# EAGLE schematic esquematico (EAGLE 8.4.0)
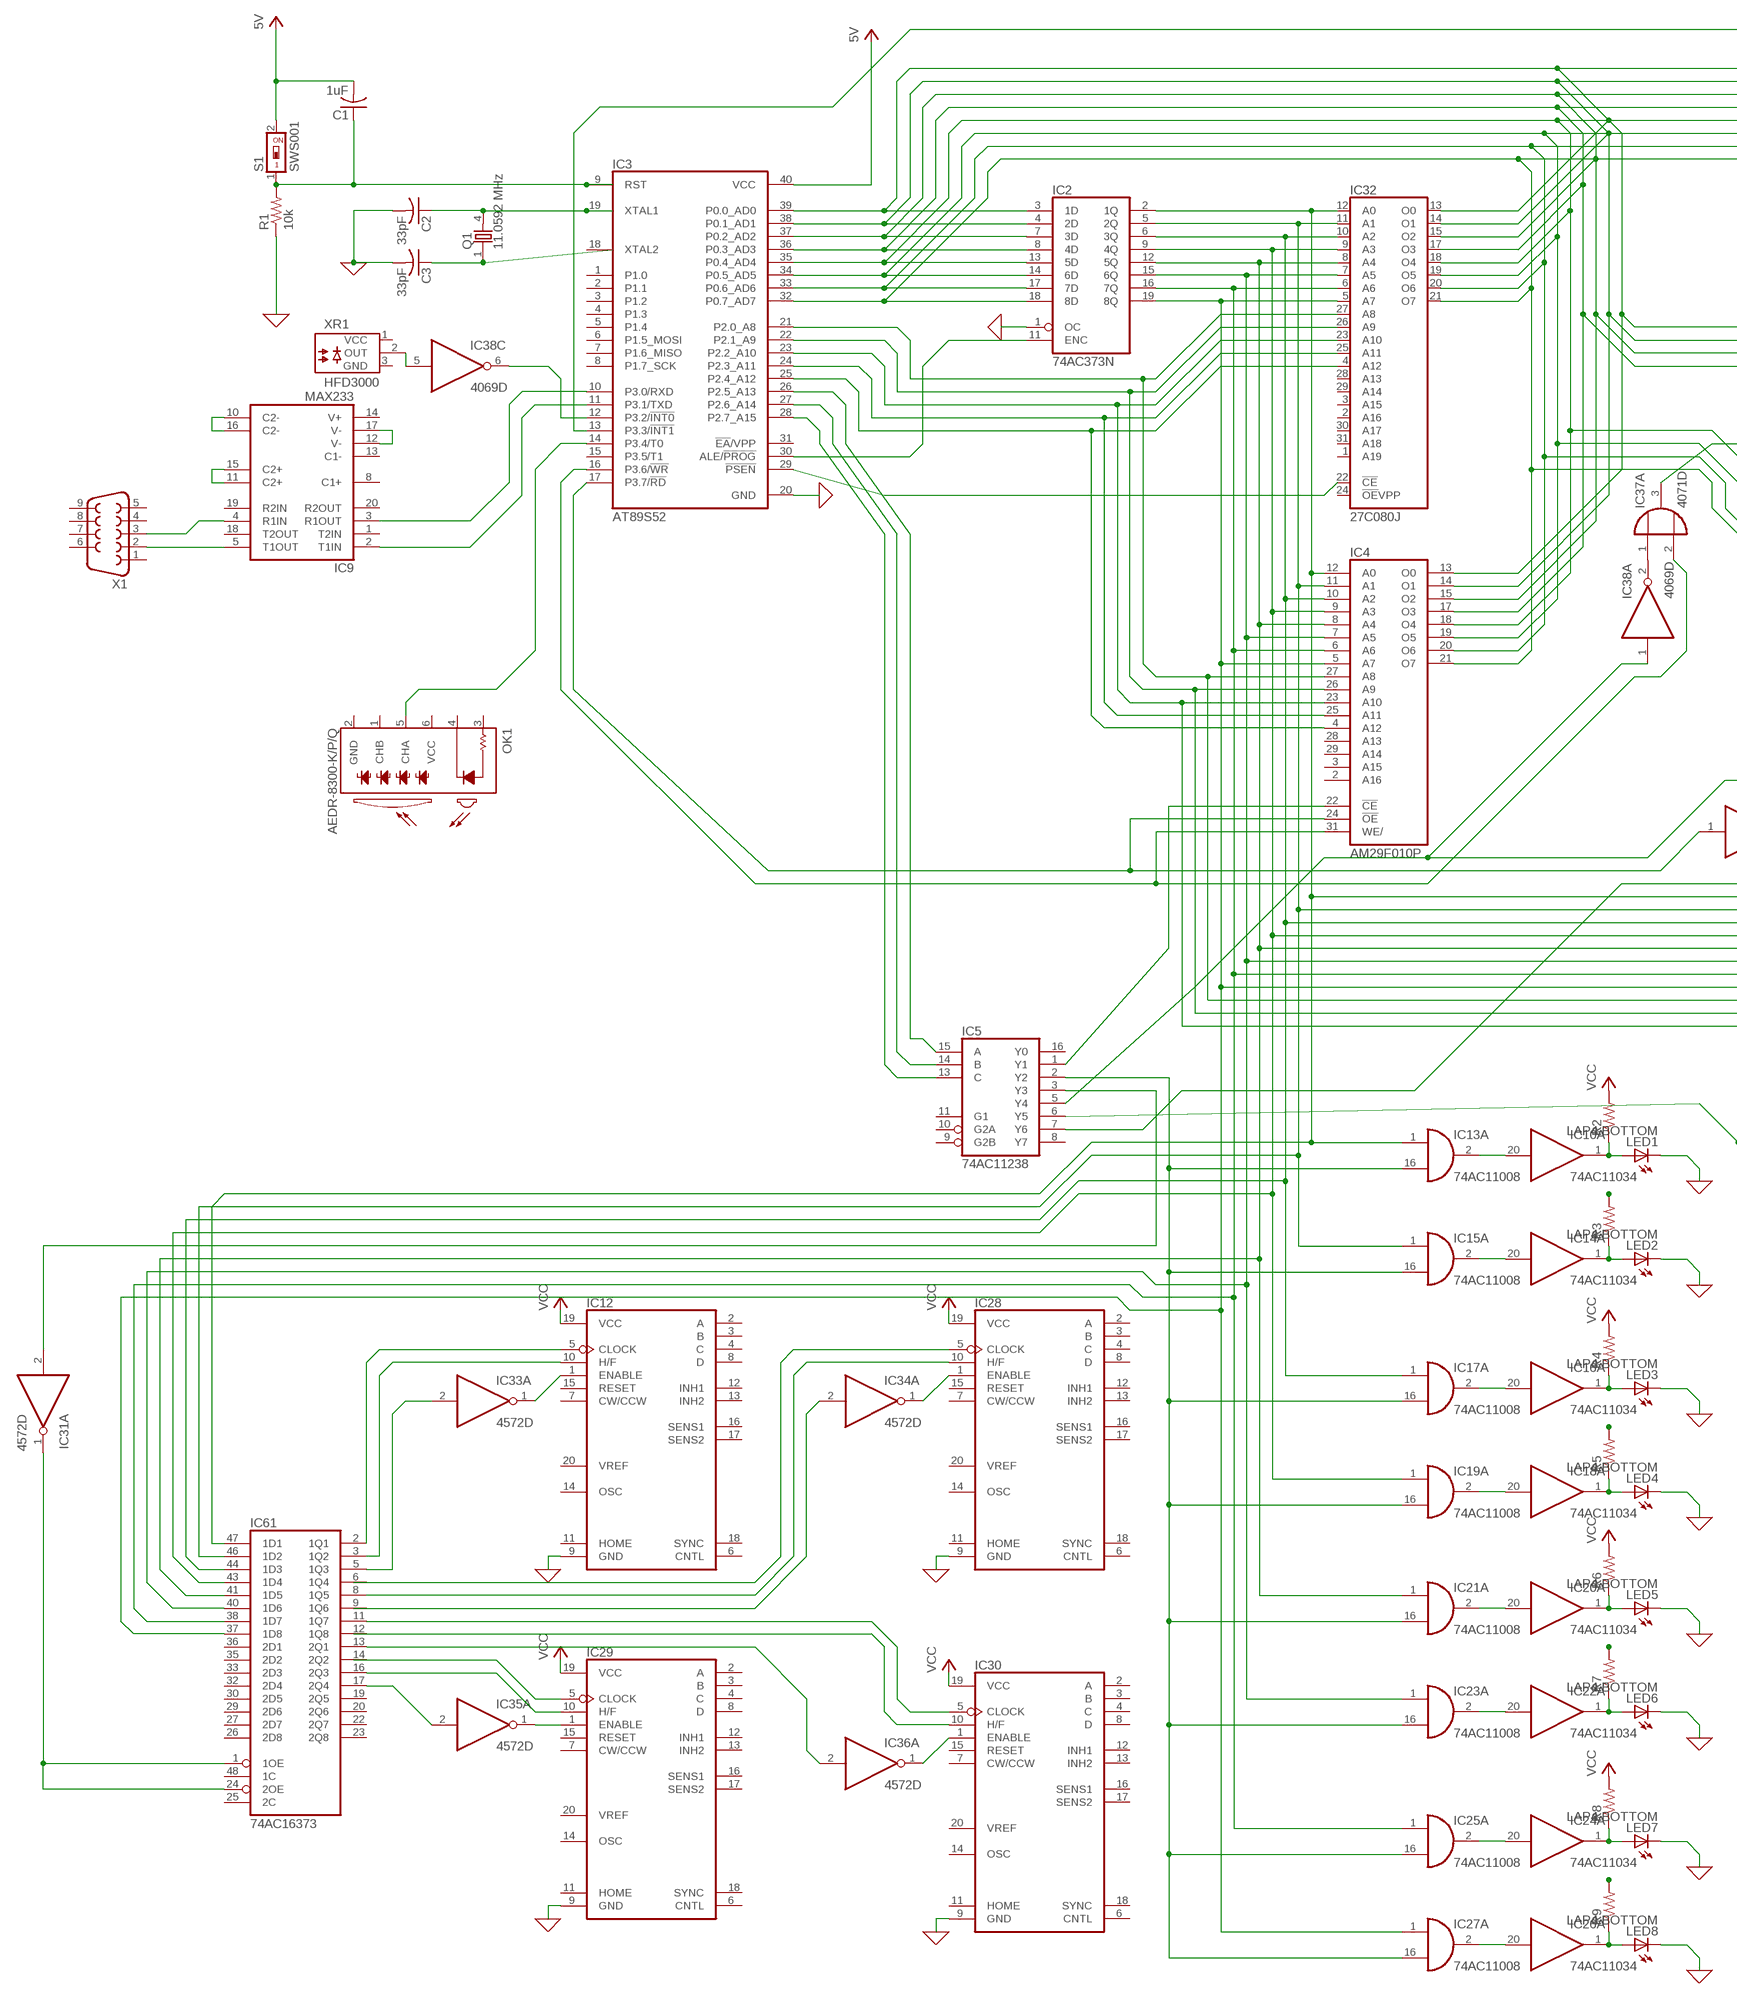
[diagram p0: schematic, sheet 1, part 1 of 2]
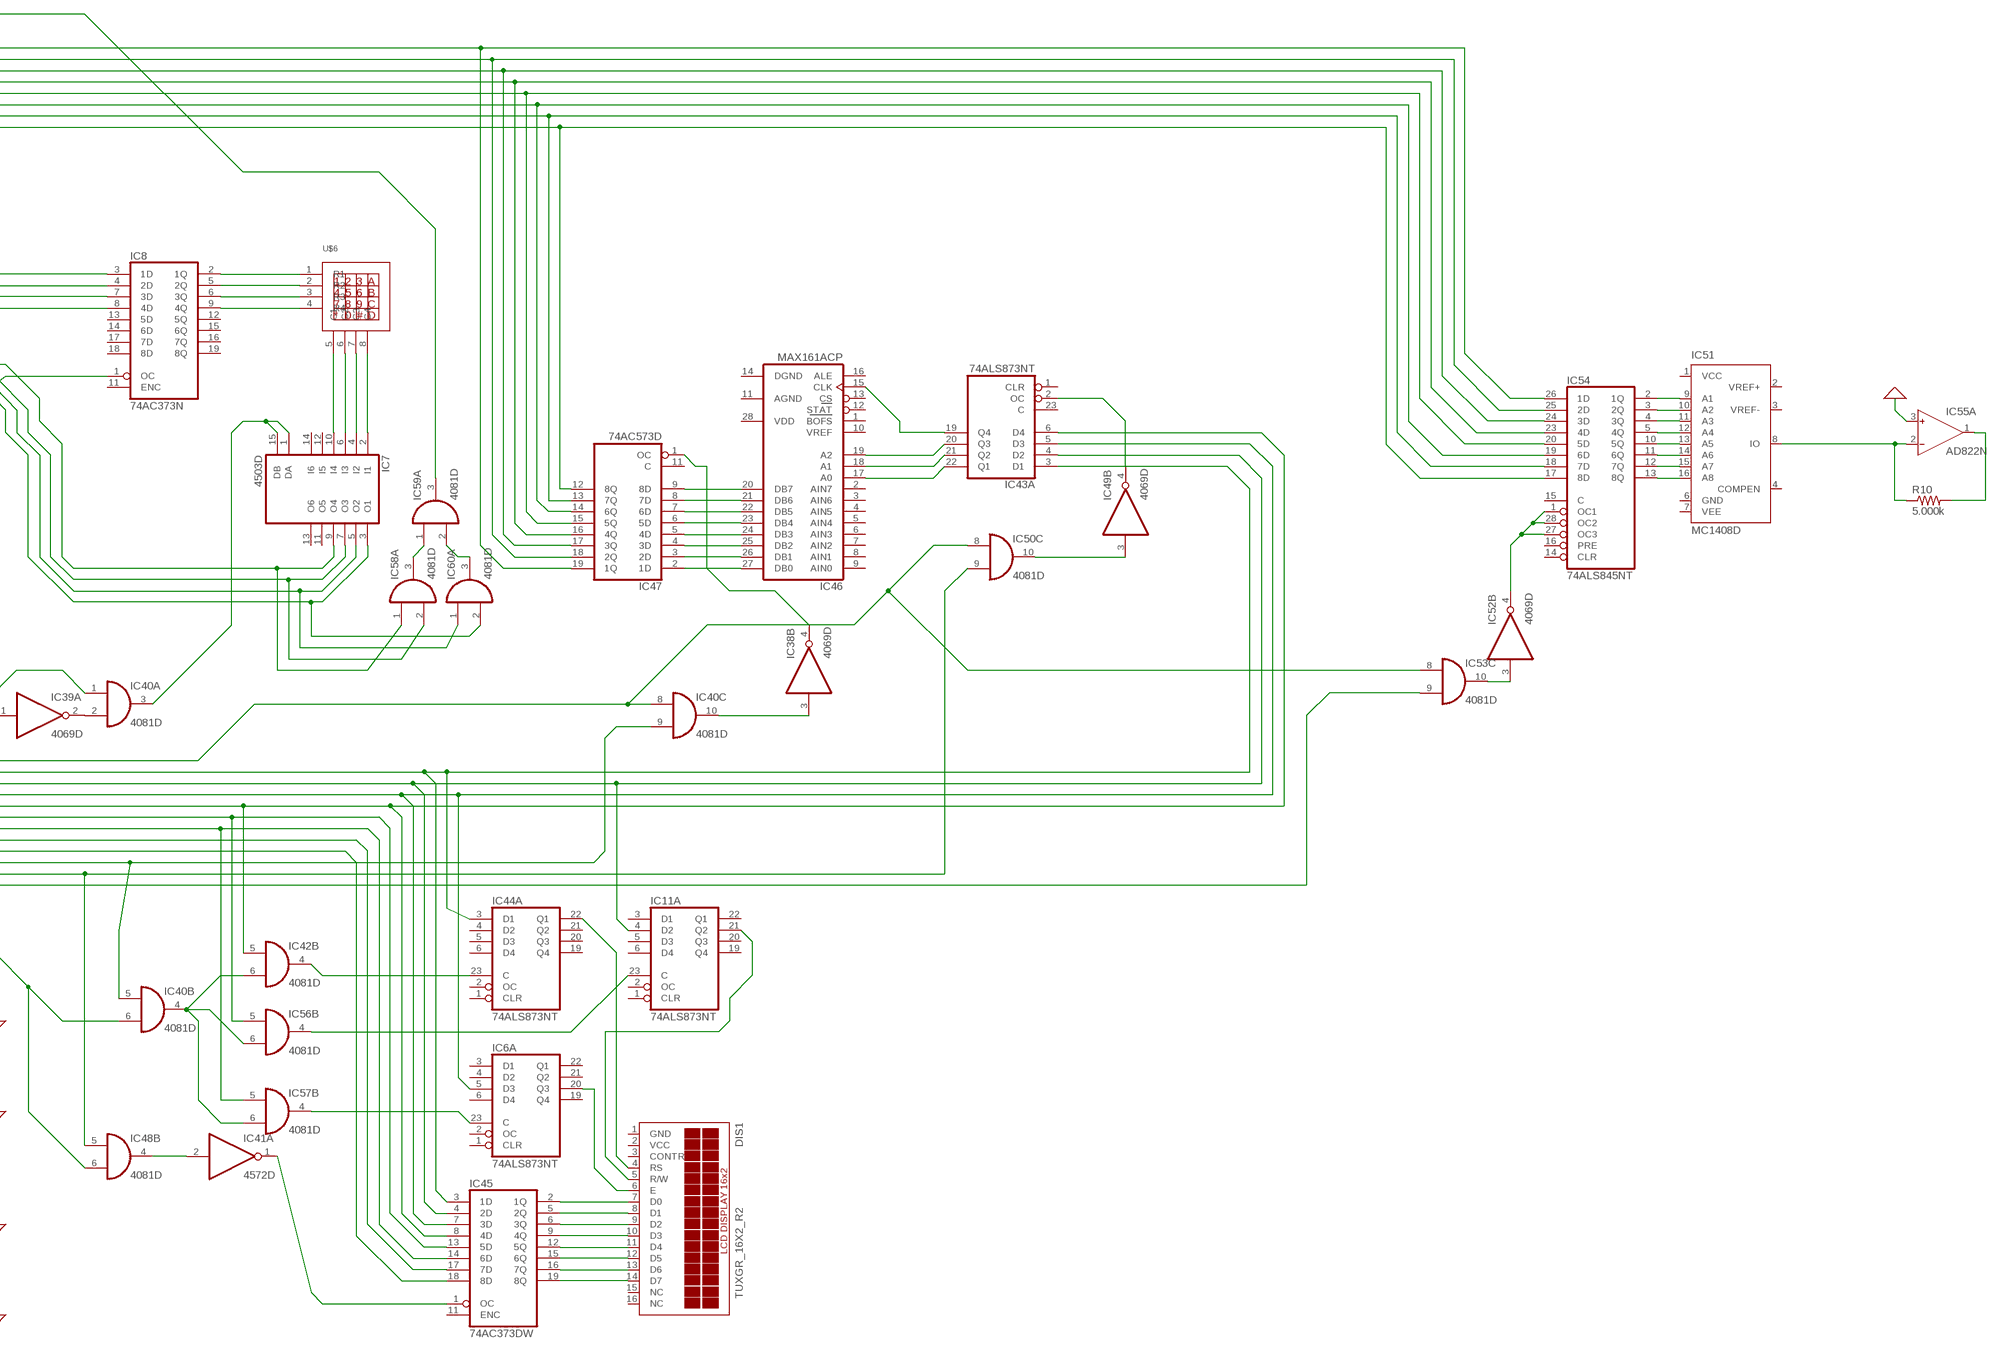
[diagram p1: schematic, sheet 1, part 2 of 2]

## Parts
C1  1uF  C-US025-024X044  [C025-024X044]
C2  33pF  C-US025-024X044  [C025-024X044]
C3  33pF  C-US025-024X044  [C025-024X044]
DIS1  TUXGR_16X2_R2  [TUXGR_16X2_R2]
IC2  74AC373N  [DIL20]
IC3  AT89S52  AT89S51-33P  [DIL40]
IC4  AM29F010P  [DIL32-3]
IC5  74AC11238  [DIL16]
IC6  74ALS873NT  [DIL24-6]
IC7  4503D  [SO16]
IC8  74AC373N  [DIL20]
IC9  MAX233  [DIL20]
IC10  74AC11034  [DIL20]
IC11  74ALS873NT  [DIL24-6]
IC12  L297ADIL20-1  [DIL20]
IC13  74AC11008  [DIL16]
IC14  74AC11034  [DIL20]
IC15  74AC11008  [DIL16]
IC16  74AC11034  [DIL20]
IC17  74AC11008  [DIL16]
IC18  74AC11034  [DIL20]
IC19  74AC11008  [DIL16]
IC20  74AC11034  [DIL20]
IC21  74AC11008  [DIL16]
IC22  74AC11034  [DIL20]
IC23  74AC11008  [DIL16]
IC24  74AC11034  [DIL20]
IC25  74AC11008  [DIL16]
IC26  74AC11034  [DIL20]
IC27  74AC11008  [DIL16]
IC28  L297ADIL20-1  [DIL20]
IC29  L297ADIL20-1  [DIL20]
IC30  L297ADIL20-1  [DIL20]
IC31  4572D  [SO16]
IC32  27C080J  [PLCC32R]
IC33  4572D  [SO16]
IC34  4572D  [SO16]
IC35  4572D  [SO16]
IC36  4572D  [SO16]
IC37  4071D  [SO14]
IC38  4069D  [SO14]
IC39  4069D  [SO14]
IC40  4081D  [SO14]
IC41  4572D  [SO16]
IC42  4081D  [SO14]
IC43  74ALS873NT  [DIL24-6]
IC44  74ALS873NT  [DIL24-6]
IC45  74AC373DW  [SO20W]
IC46  MAX161ACP  [DIL28-6]
IC47  74AC573D  [SO20W]
IC48  4081D  [SO14]
IC49  4069D  [SO14]
IC50  4081D  [SO14]
IC51  MC1408D  [SO16]
IC52  4069D  [SO14]
IC53  4081D  [SO14]
IC54  74ALS845NT  [DIL28-6]
IC55  AD822N  [DIL08]
IC56  4081D  [SO14]
IC57  4081D  [SO14]
IC58  4081D  [SO14]
IC59  4081D  [SO14]
IC60  4081D  [SO14]
IC61  74AC16373  [SSOP48DL]
LED1  LAP4-BOTTOM  [P47F-BOTTOM]
LED2  LAP4-BOTTOM  [P47F-BOTTOM]
LED3  LAP4-BOTTOM  [P47F-BOTTOM]
LED4  LAP4-BOTTOM  [P47F-BOTTOM]
LED5  LAP4-BOTTOM  [P47F-BOTTOM]
LED6  LAP4-BOTTOM  [P47F-BOTTOM]
LED7  LAP4-BOTTOM  [P47F-BOTTOM]
LED8  LAP4-BOTTOM  [P47F-BOTTOM]
OK1  AEDR-8300-K/P/Q  [AEDR-8300]
Q1  11.0592 MHz  86SMX  [86SMX]
R1  10k  R-US_0207/10  [0207/10]
R2  R-US_0204/2V  [0204V]
R3  R-US_0204/2V  [0204V]
R4  R-US_0204/2V  [0204V]
R5  R-US_0204/2V  [0204V]
R6  R-US_0204/2V  [0204V]
R7  R-US_0204/2V  [0204V]
R8  R-US_0204/2V  [0204V]
R9  R-US_0204/2V  [0204V]
R10  5.000k  R-US_0204/2V  [0204V]
S1  SWS001  [SMS-001]
U$6  KEYPAD4X4  [KEYPAD4X4]
X1  F09VB  [F09VB]
XR1  HFD3000  [TO46-FW3]

## Nets
0: C2.2 C3.2 IC2.1(OC) IC3.20(GND) IC12.9(GND) IC28.9(GND) IC29.9(GND) IC30.9(GND) IC55.3(A:IN+) LED1.C LED2.C LED3.C LED4.C LED5.C LED6.C LED7.C LED8.C R1.1 ; supply symbol labelled GND
N$1: C2.1 IC3.19(XTAL1) Q1.4
N$2: C3.1 Q1.1
N$3: C1.1 IC3.9(RST) R1.2 S1.1
N$4: DIS1.6(E) IC6.20(A:Q3)
N$5: IC4.22(!CE) IC5.1(Y1)
N$6: IC2.7(3D) IC3.37(P0.2_AD2) IC4.15(O2) IC8.7(3D) IC32.15(O2) IC47.17(3Q) IC54.24(3D)
N$7: IC2.14(6D) IC3.34(P0.5_AD5) IC4.19(O5) IC7.7(O3) IC32.19(O5) IC47.14(6Q) IC54.19(6D) IC58.2(A:I1)
N$8: IC3.10(P3.0/RXD) IC9.3(R1OUT)
N$9: IC8.2(1Q) U$6.1(R1)
N$10: IC2.3(1D) IC3.39(P0.0_AD0) IC4.13(O0) IC8.3(1D) IC32.13(O0) IC47.19(1Q) IC54.26(1D)
N$11: IC2.18(8D) IC3.32(P0.7_AD7) IC4.21(O7) IC7.3(O1) IC32.21(O7) IC47.12(8Q) IC54.17(8D) IC60.2(A:I1)
N$12: IC2.11(ENC) IC3.30(ALE/!PROG)
N$13: IC2.2(1Q) IC4.12(A0) IC13.1(A:I0) IC32.12(A0) IC43.3(A:D1) IC44.3(A:D1) IC45.3(1D) IC61.47(1D1)
N$14: IC2.5(2Q) IC4.11(A1) IC11.4(A:D2) IC15.1(A:I0) IC32.11(A1) IC43.4(A:D2) IC45.4(2D) IC61.46(1D2)
N$15: IC38.5(C:I) XR1.2(OUT)
N$16: IC2.9(4Q) IC4.9(A3) IC19.1(A:I0) IC32.9(A3) IC42.5(B:I0) IC43.6(A:D4) IC45.8(4D) IC61.43(1D4)
N$17: IC2.12(5Q) IC4.8(A4) IC21.1(A:I0) IC32.8(A4) IC45.13(5D) IC56.5(B:I0) IC61.41(1D5)
N$18: IC2.19(8Q) IC4.5(A7) IC27.1(A:I0) IC32.5(A7) IC45.18(8D) IC61.37(1D8)
N$19: IC3.12(P3.2/!INT0) IC38.6(C:O)
N$20: IC3.28(P2.7_A15) IC5.13(C)
N$21: IC3.21(P2.0_A8) IC4.27(A8) IC32.27(A8) IC40.5(B:I0) IC40.9(C:I1)
N$22: IC3.22(P2.1_A9) IC4.26(A9) IC32.26(A9) IC48.5(B:I0) IC50.9(C:I1)
N$23: IC3.23(P2.2_A10) IC4.23(A10) IC32.23(A10) IC53.9(C:I1)
N$24: IC3.24(P2.3_A11) IC4.25(A11) IC32.25(A11)
N$25: IC3.27(P2.6_A14) IC5.14(B)
N$26: DIS1.5(R/W) IC11.21(A:Q2)
N$27: IC8.5(2Q) U$6.2(R2)
N$28: IC3.25(P2.4_A12) IC4.4(A12) IC32.4(A12)
N$30: IC8.6(3Q) U$6.3(R3)
N$31: IC3.29(!PSEN)
N$33: IC2.15(6Q) IC4.7(A5) IC23.1(A:I0) IC32.7(A5) IC45.14(6D) IC57.5(B:I0) IC61.40(1D6)
N$34: IC8.9(4Q) U$6.4(R4)
N$35: IC7.2(I1) U$6.8(C4)
N$36: IC2.17(7D) IC3.33(P0.6_AD6) IC4.20(O6) IC7.5(O2) IC32.20(O6) IC47.13(7Q) IC54.18(7D) IC60.1(A:I0)
N$37: IC2.8(4D) IC3.36(P0.3_AD3) IC4.17(O3) IC8.8(4D) IC32.17(O3) IC47.16(4Q) IC54.23(4D)
N$38: IC7.4(I2) U$6.7(C3)
N$39: IC2.4(2D) IC3.38(P0.1_AD1) IC4.14(O1) IC8.4(2D) IC32.14(O1) IC47.18(2Q) IC54.25(2D)
N$40: IC7.6(I3) U$6.6(C2)
N$41: IC7.10(I4) U$6.5(C1)
N$42: IC2.13(5D) IC3.35(P0.4_AD4) IC4.18(O4) IC7.9(O4) IC32.18(O4) IC47.15(5Q) IC54.20(5D) IC58.1(A:I0)
N$43: IC3.11(P3.1/TXD) IC9.2(T1IN)
N$44: IC9.4(R1IN) X1.3
N$45: IC9.5(T1OUT) X1.2
N$46: IC9.10(C2-) IC9.16(C2-)
N$47: IC9.11(C2+) IC9.15(C2+)
N$48: IC9.12(V-) IC9.17(V-)
N$49: IC10.20(A:I) IC13.2(A:O)
N$50: IC10.1(A:O) LED1.A R2.1
N$51: IC3.26(P2.5_A13) IC5.15(A)
N$52: DIS1.4(RS) IC44.22(A:Q1)
N$53: IC31.1(A:O) IC61.1(1OE) IC61.24(2OE)
N$54: IC12.5(CLOCK) IC61.2(1Q1)
N$55: IC14.20(A:I) IC15.2(A:O)
N$56: IC14.1(A:O) LED2.A R3.1
N$57: IC12.10(H/F) IC61.3(1Q2)
N$58: IC16.20(A:I) IC17.2(A:O)
N$59: IC16.1(A:O) LED3.A R4.1
N$60: IC33.2(A:I) IC61.5(1Q3)
N$61: IC18.20(A:I) IC19.2(A:O)
N$62: IC18.1(A:O) LED4.A R5.1
N$63: IC5.3(Y3) IC31.2(A:I)
N$64: IC20.20(A:I) IC21.2(A:O)
N$65: IC20.1(A:O) LED5.A R6.1
N$66: IC12.1(ENABLE) IC33.1(A:O)
N$67: IC22.20(A:I) IC23.2(A:O)
N$68: IC22.1(A:O) LED6.A R7.1
N$69: IC3.17(P3.7/!RD) IC4.24(!OE) IC39.1(A:I)
N$70: IC24.20(A:I) IC25.2(A:O)
N$71: IC24.1(A:O) LED7.A R8.1
N$72: IC28.5(CLOCK) IC61.6(1Q4)
N$73: IC26.20(A:I) IC27.2(A:O)
N$74: IC26.1(A:O) LED8.A R9.1
N$75: IC28.10(H/F) IC61.8(1Q5)
N$76: IC34.2(A:I) IC61.9(1Q6)
N$77: IC30.5(CLOCK) IC61.11(1Q7)
N$78: IC30.10(H/F) IC61.12(1Q8)
N$79: IC36.2(A:I) IC61.13(2Q1)
N$80: IC29.5(CLOCK) IC61.14(2Q2)
N$81: IC29.10(H/F) IC61.16(2Q3)
N$82: IC29.1(ENABLE) IC35.1(A:O)
N$83: IC35.2(A:I) IC61.17(2Q4)
N$84: IC5.5(Y4) IC38.1(A:I) IC40.1(A:I0)
N$85: IC28.1(ENABLE) IC34.1(A:O)
N$86: IC8.1(OC) IC37.3(A:O)
N$87: IC30.1(ENABLE) IC36.1(A:O)
N$88: IC37.1(A:I0) IC38.2(A:O)
N$89: IC39.2(A:O) IC40.2(A:I1)
N$90: IC7.1(DA) IC7.15(DB) IC40.3(A:O)
N$91: IC5.6(Y5) IC40.6(B:I1) IC48.6(B:I1)
N$92: IC40.4(B:O) IC42.6(B:I1) IC56.6(B:I1) IC57.6(B:I1)
N$93: IC42.4(B:O) IC44.23(A:C)
N$94: IC11.23(A:C) IC56.4(B:O)
N$95: DIS1.7(D0) IC45.2(1Q)
N$96: DIS1.8(D1) IC45.5(2Q)
N$97: DIS1.9(D2) IC45.6(3Q)
N$98: DIS1.10(D3) IC45.9(4Q)
N$99: DIS1.11(D4) IC45.12(5Q)
N$100: DIS1.12(D5) IC45.15(6Q)
N$101: DIS1.13(D6) IC45.16(7Q)
N$102: DIS1.14(D7) IC45.19(8Q)
N$103: IC6.23(A:C) IC57.4(B:O)
N$104: IC43.22(A:Q1) IC46.17(A0)
N$105: IC41.1(A:O) IC45.1(OC)
N$106: IC43.21(A:Q2) IC46.18(A1)
N$107: IC43.20(A:Q3) IC46.19(A2)
N$108: IC43.19(A:Q4) IC46.15(CLK)
N$109: IC46.20(DB7) IC47.9(8D)
N$110: IC46.21(DB6) IC47.8(7D)
N$111: IC46.22(DB5) IC47.7(6D)
N$112: IC46.23(DB4) IC47.6(5D)
N$113: IC46.24(DB3) IC47.5(4D)
N$114: IC46.26(DB1) IC47.3(2D)
N$115: IC46.25(DB2) IC47.4(3D)
N$116: IC46.27(DB0) IC47.2(1D)
N$117: IC41.2(A:I) IC48.4(B:O)
N$118: IC49.3(B:I) IC50.10(C:O)
N$119: IC3.14(P3.4/T0) OK1.5(CHA)
N$120: IC58.3(A:O) IC59.1(A:I0)
N$121: IC43.2(A:OC) IC49.4(B:O)
N$122: IC5.7(Y6) IC40.8(C:I0) IC50.8(C:I0) IC53.8(C:I0)
N$123: IC38.3(B:I) IC40.10(C:O)
N$124: IC38.4(B:O) IC47.1(OC)
N$125: IC52.3(B:I) IC53.10(C:O)
N$126: IC59.2(A:I1) IC60.3(A:O)
N$127: IC52.4(B:O) IC54.1(OC1) IC54.27(OC3) IC54.28(OC2)
N$128: IC3.13(P3.3/!INT1) IC59.3(A:O)
N$129: IC2.16(7Q) IC4.6(A6) IC25.1(A:I0) IC32.6(A6) IC45.17(7D) IC61.38(1D7)
N$130: IC5.2(Y2) IC13.16(A:I1) IC15.16(A:I1) IC17.16(A:I1) IC19.16(A:I1) IC21.16(A:I1) IC23.16(A:I1) IC25.16(A:I1) IC27.16(A:I1)
N$131: IC2.6(3Q) IC4.10(A2) IC6.5(A:D3) IC17.1(A:I0) IC32.10(A2) IC43.5(A:D3) IC45.7(3D) IC61.44(1D3)
N$132: IC3.16(P3.6/!WR) IC4.31(WE/) IC37.2(A:I1)
N$134: IC51.9(A1) IC54.2(1Q)
N$135: IC51.10(A2) IC54.3(2Q)
N$136: IC51.11(A3) IC54.4(3Q)
N$137: IC51.12(A4) IC54.5(4Q)
N$138: IC51.13(A5) IC54.10(5Q)
N$139: IC51.14(A6) IC54.11(6Q)
N$140: IC51.15(A7) IC54.12(7Q)
N$141: IC51.16(A8) IC54.13(8Q)
N$142: IC51.8(IO) IC55.2(A:IN-) R10.1
N$144: IC55.1(A:OUT) R10.2
VCC: C1.2 IC3.40(VCC) IC12.19(VCC) IC28.19(VCC) IC29.19(VCC) IC30.19(VCC) R2.2 R4.2 R6.2 R8.2 S1.2 ; supply symbol labelled 5V
VCC1: R3.2
VCC2: R5.2
VCC3: R7.2
VCC4: R9.2
Unconnected: DIS1.3(CONTR) DIS1.15(NC) DIS1.16(NC) IC3.1(P1.0) IC3.2(P1.1) IC3.3(P1.2) IC3.4(P1.3) IC3.5(P1.4) IC3.6(P1.5_MOSI) IC3.7(P1.6_MISO) IC3.8(P1.7_SCK) IC3.15(P3.5/T1) IC3.18(XTAL2) IC3.31(!EA!/VPP) IC4.1(NC) IC4.2(A16) IC4.3(A15) IC4.28(A13) IC4.29(A14) IC4.30(NC) IC5.8(Y7) IC5.9(G2B) IC5.10(G2A) IC5.11(G1) IC5.16(Y0) IC6.1(A:CLR) IC6.2(A:OC) IC6.3(A:D1) IC6.4(A:D2) IC6.6(A:D4) IC6.7(B:D1) IC6.8(B:D2) IC6.9(B:D3) IC6.10(B:D4) IC6.11(B:OC) IC6.13(B:CLR) IC6.14(B:C) IC6.15(B:Q4) IC6.16(B:Q3) IC6.17(B:Q2) IC6.18(B:Q1) IC6.19(A:Q4) IC6.21(A:Q2) IC6.22(A:Q1) IC7.11(O5) IC7.12(I5) IC7.13(O6) IC7.14(I6) IC8.11(ENC) IC8.12(5Q) IC8.13(5D) IC8.14(6D) IC8.15(6Q) IC8.16(7Q) IC8.17(7D) IC8.18(8D) IC8.19(8Q) IC9.1(T2IN) IC9.8(C1+) IC9.13(C1-) IC9.14(V+) IC9.18(T2OUT) IC9.19(R2IN) IC9.20(R2OUT) IC10.2(B:O) IC10.3(C:O) IC10.8(D:O) IC10.9(E:O) IC10.10(F:O) IC10.11(F:I) IC10.12(E:I) IC10.13(D:I) IC10.18(C:I) IC10.19(B:I) IC11.1(A:CLR) IC11.2(A:OC) IC11.3(A:D1) IC11.5(A:D3) IC11.6(A:D4) IC11.7(B:D1) IC11.8(B:D2) IC11.9(B:D3) IC11.10(B:D4) IC11.11(B:OC) IC11.13(B:CLR) IC11.14(B:C) IC11.15(B:Q4) IC11.16(B:Q3) IC11.17(B:Q2) IC11.18(B:Q1) IC11.19(A:Q4) IC11.20(A:Q3) IC11.22(A:Q1) IC12.2(A) IC12.3(B) IC12.4(C) IC12.6(CNTL) IC12.7(CW/CCW) IC12.8(D) IC12.11(HOME) IC12.12(INH1) IC12.13(INH2) IC12.14(OSC) IC12.15(RESET) IC12.16(SENS1) IC12.17(SENS2) IC12.18(SYNC) IC12.20(VREF) IC13.3(B:O) IC13.6(C:O) IC13.7(D:O) IC13.8(D:I1) IC13.9(D:I0) IC13.10(C:I1) IC13.11(C:I0) IC13.14(B:I1) IC13.15(B:I0) IC14.2(B:O) IC14.3(C:O) IC14.8(D:O) IC14.9(E:O) IC14.10(F:O) IC14.11(F:I) IC14.12(E:I) IC14.13(D:I) IC14.18(C:I) IC14.19(B:I) IC15.3(B:O) IC15.6(C:O) IC15.7(D:O) IC15.8(D:I1) IC15.9(D:I0) IC15.10(C:I1) IC15.11(C:I0) IC15.14(B:I1) IC15.15(B:I0) IC16.2(B:O) IC16.3(C:O) IC16.8(D:O) IC16.9(E:O) IC16.10(F:O) IC16.11(F:I) IC16.12(E:I) IC16.13(D:I) IC16.18(C:I) IC16.19(B:I) IC17.3(B:O) IC17.6(C:O) IC17.7(D:O) IC17.8(D:I1) IC17.9(D:I0) IC17.10(C:I1) IC17.11(C:I0) IC17.14(B:I1) IC17.15(B:I0) IC18.2(B:O) IC18.3(C:O) IC18.8(D:O) IC18.9(E:O) IC18.10(F:O) IC18.11(F:I) IC18.12(E:I) IC18.13(D:I) IC18.18(C:I) IC18.19(B:I) IC19.3(B:O) IC19.6(C:O) IC19.7(D:O) IC19.8(D:I1) IC19.9(D:I0) IC19.10(C:I1) IC19.11(C:I0) IC19.14(B:I1) IC19.15(B:I0) IC20.2(B:O) IC20.3(C:O) IC20.8(D:O) IC20.9(E:O) IC20.10(F:O) IC20.11(F:I) IC20.12(E:I) IC20.13(D:I) IC20.18(C:I) IC20.19(B:I) IC21.3(B:O) IC21.6(C:O) IC21.7(D:O) IC21.8(D:I1) IC21.9(D:I0) IC21.10(C:I1) IC21.11(C:I0) IC21.14(B:I1) IC21.15(B:I0) IC22.2(B:O) IC22.3(C:O) IC22.8(D:O) IC22.9(E:O) IC22.10(F:O) IC22.11(F:I) IC22.12(E:I) IC22.13(D:I) IC22.18(C:I) IC22.19(B:I) IC23.3(B:O) IC23.6(C:O) IC23.7(D:O) IC23.8(D:I1) IC23.9(D:I0) IC23.10(C:I1) IC23.11(C:I0) IC23.14(B:I1) IC23.15(B:I0) IC24.2(B:O) IC24.3(C:O) IC24.8(D:O) IC24.9(E:O) IC24.10(F:O) IC24.11(F:I) IC24.12(E:I) IC24.13(D:I) IC24.18(C:I) IC24.19(B:I) IC25.3(B:O) IC25.6(C:O) IC25.7(D:O) IC25.8(D:I1) IC25.9(D:I0) IC25.10(C:I1) IC25.11(C:I0) IC25.14(B:I1) IC25.15(B:I0) IC26.2(B:O) IC26.3(C:O) IC26.8(D:O) IC26.9(E:O) IC26.10(F:O) IC26.11(F:I) IC26.12(E:I) IC26.13(D:I) IC26.18(C:I) IC26.19(B:I) IC27.3(B:O) IC27.6(C:O) IC27.7(D:O) IC27.8(D:I1) IC27.9(D:I0) IC27.10(C:I1) IC27.11(C:I0) IC27.14(B:I1) IC27.15(B:I0) IC28.2(A) IC28.3(B) IC28.4(C) IC28.6(CNTL) IC28.7(CW/CCW) IC28.8(D) IC28.11(HOME) IC28.12(INH1) IC28.13(INH2) IC28.14(OSC) IC28.15(RESET) IC28.16(SENS1) IC28.17(SENS2) IC28.18(SYNC) IC28.20(VREF) IC29.2(A) IC29.3(B) IC29.4(C) IC29.6(CNTL) IC29.7(CW/CCW) IC29.8(D) IC29.11(HOME) IC29.12(INH1) IC29.13(INH2) IC29.14(OSC) IC29.15(RESET) IC29.16(SENS1) IC29.17(SENS2) IC29.18(SYNC) IC29.20(VREF) IC30.2(A) IC30.3(B) IC30.4(C) IC30.6(CNTL) IC30.7(CW/CCW) IC30.8(D) IC30.11(HOME) IC30.12(INH1) IC30.13(INH2) IC30.14(OSC) IC30.15(RESET) IC30.16(SENS1) IC30.17(SENS2) IC30.18(SYNC) IC30.20(VREF) IC31.3(B:O) IC31.4(B:I) IC31.5(E:O) IC31.6(E:I0) IC31.7(E:I1) IC31.9(C:O) IC31.10(C:I) IC31.11(D:O) IC31.12(D:I) IC31.13(F:O) IC31.14(F:I0) IC31.15(F:I1) IC32.1(A19) IC32.2(A16) IC32.3(A15) IC32.22(!CE) IC32.24(!OE!VPP) IC32.28(A13) IC32.29(A14) IC32.30(A17) IC32.31(A18) IC33.3(B:O) IC33.4(B:I) IC33.5(E:O) IC33.6(E:I0) IC33.7(E:I1) IC33.9(C:O) IC33.10(C:I) IC33.11(D:O) IC33.12(D:I) IC33.13(F:O) IC33.14(F:I0) IC33.15(F:I1) IC34.3(B:O) IC34.4(B:I) IC34.5(E:O) IC34.6(E:I0) IC34.7(E:I1) IC34.9(C:O) IC34.10(C:I) IC34.11(D:O) IC34.12(D:I) IC34.13(F:O) IC34.14(F:I0) IC34.15(F:I1) IC35.3(B:O) IC35.4(B:I) IC35.5(E:O) IC35.6(E:I0) IC35.7(E:I1) IC35.9(C:O) IC35.10(C:I) IC35.11(D:O) IC35.12(D:I) IC35.13(F:O) IC35.14(F:I0) IC35.15(F:I1) IC36.3(B:O) IC36.4(B:I) IC36.5(E:O) IC36.6(E:I0) IC36.7(E:I1) IC36.9(C:O) IC36.10(C:I) IC36.11(D:O) IC36.12(D:I) IC36.13(F:O) IC36.14(F:I0) IC36.15(F:I1) IC37.4(B:O) IC37.5(B:I0) IC37.6(B:I1) IC37.8(C:I0) IC37.9(C:I1) IC37.10(C:O) IC37.11(D:O) IC37.12(D:I0) IC37.13(D:I1) IC38.8(D:O) IC38.9(D:I) IC38.10(E:O) IC38.11(E:I) IC38.12(F:O) IC38.13(F:I) IC39.3(B:I) IC39.4(B:O) IC39.5(C:I) IC39.6(C:O) IC39.8(D:O) IC39.9(D:I) IC39.10(E:O) IC39.11(E:I) IC39.12(F:O) IC39.13(F:I) IC40.11(D:O) IC40.12(D:I0) IC40.13(D:I1) IC41.3(B:O) IC41.4(B:I) IC41.5(E:O) IC41.6(E:I0) IC41.7(E:I1) IC41.9(C:O) IC41.10(C:I) IC41.11(D:O) IC41.12(D:I) IC41.13(F:O) IC41.14(F:I0) IC41.15(F:I1) IC42.1(A:I0) IC42.2(A:I1) IC42.3(A:O) IC42.8(C:I0) IC42.9(C:I1) IC42.10(C:O) IC42.11(D:O) IC42.12(D:I0) IC42.13(D:I1) IC43.1(A:CLR) IC43.7(B:D1) IC43.8(B:D2) IC43.9(B:D3) IC43.10(B:D4) IC43.11(B:OC) IC43.13(B:CLR) IC43.14(B:C) IC43.15(B:Q4) IC43.16(B:Q3) IC43.17(B:Q2) IC43.18(B:Q1) IC43.23(A:C) IC44.1(A:CLR) IC44.2(A:OC) IC44.4(A:D2) IC44.5(A:D3) IC44.6(A:D4) IC44.7(B:D1) IC44.8(B:D2) IC44.9(B:D3) IC44.10(B:D4) IC44.11(B:OC) IC44.13(B:CLR) IC44.14(B:C) IC44.15(B:Q4) IC44.16(B:Q3) IC44.17(B:Q2) IC44.18(B:Q1) IC44.19(A:Q4) IC44.20(A:Q3) IC44.21(A:Q2) IC45.11(ENC) IC46.1(BOFS) IC46.2(AIN7) IC46.3(AIN6) IC46.4(AIN5) IC46.5(AIN4) IC46.6(AIN3) IC46.7(AIN2) IC46.8(AIN1) IC46.9(AIN0) IC46.10(VREF) IC46.12(STAT) IC46.13(CS) IC46.16(ALE) IC47.11(C) IC48.1(A:I0) IC48.2(A:I1) IC48.3(A:O) IC48.8(C:I0) IC48.9(C:I1) IC48.10(C:O) IC48.11(D:O) IC48.12(D:I0) IC48.13(D:I1) IC49.1(A:I) IC49.2(A:O) IC49.5(C:I) IC49.6(C:O) IC49.8(D:O) IC49.9(D:I) IC49.10(E:O) IC49.11(E:I) IC49.12(F:O) IC49.13(F:I) IC50.1(A:I0) IC50.2(A:I1) IC50.3(A:O) IC50.4(B:O) IC50.5(B:I0) IC50.6(B:I1) IC50.11(D:O) IC50.12(D:I0) IC50.13(D:I1) IC51.2(VREF+) IC51.3(VREF-) IC51.4(COMPEN) IC52.1(A:I) IC52.2(A:O) IC52.5(C:I) IC52.6(C:O) IC52.8(D:O) IC52.9(D:I) IC52.10(E:O) IC52.11(E:I) IC52.12(F:O) IC52.13(F:I) IC53.1(A:I0) IC53.2(A:I1) IC53.3(A:O) IC53.4(B:O) IC53.5(B:I0) IC53.6(B:I1) IC53.11(D:O) IC53.12(D:I0) IC53.13(D:I1) IC54.14(CLR) IC54.15(C) IC54.16(PRE) IC55.5(B:IN+) IC55.6(B:IN-) IC55.7(B:OUT) IC56.1(A:I0) IC56.2(A:I1) IC56.3(A:O) IC56.8(C:I0) IC56.9(C:I1) IC56.10(C:O) IC56.11(D:O) IC56.12(D:I0) IC56.13(D:I1) IC57.1(A:I0) IC57.2(A:I1) IC57.3(A:O) IC57.8(C:I0) IC57.9(C:I1) IC57.10(C:O) IC57.11(D:O) IC57.12(D:I0) IC57.13(D:I1) IC58.4(B:O) IC58.5(B:I0) IC58.6(B:I1) IC58.8(C:I0) IC58.9(C:I1) IC58.10(C:O) IC58.11(D:O) IC58.12(D:I0) IC58.13(D:I1) IC59.4(B:O) IC59.5(B:I0) IC59.6(B:I1) IC59.8(C:I0) IC59.9(C:I1) IC59.10(C:O) IC59.11(D:O) IC59.12(D:I0) IC59.13(D:I1) IC60.4(B:O) IC60.5(B:I0) IC60.6(B:I1) IC60.8(C:I0) IC60.9(C:I1) IC60.10(C:O) IC60.11(D:O) IC60.12(D:I0) IC60.13(D:I1) IC61.19(2Q5) IC61.20(2Q6) IC61.22(2Q7) IC61.23(2Q8) IC61.25(2C) IC61.26(2D8) IC61.27(2D7) IC61.29(2D6) IC61.30(2D5) IC61.32(2D4) IC61.33(2D3) IC61.35(2D2) IC61.36(2D1) IC61.48(1C) OK1.1(CHB) OK1.2(GND) OK1.3(A) OK1.4(C) OK1.6(VCC) X1.1 X1.4 X1.5 X1.6 X1.7 X1.8 X1.9

## Power pins joined to a net without a drawn wire
AGND: IC46.11(AGND)
DGND: IC46.14(DGND)
GND: DIS1.1(GND) IC2.10(GND) IC4.16(GND) IC5.4(GND) IC6.12(P:GND) IC8.10(GND) IC9.6(GND) IC9.9(GND) IC10.4(P:GND) IC10.5(P:GND) IC10.6(P:GND) IC10.7(P:GND) IC11.12(P:GND) IC13.4(P:GND) IC13.5(P:GND) IC14.4(P:GND) IC14.5(P:GND) IC14.6(P:GND) IC14.7(P:GND) IC15.4(P:GND) IC15.5(P:GND) IC16.4(P:GND) IC16.5(P:GND) IC16.6(P:GND) IC16.7(P:GND) IC17.4(P:GND) IC17.5(P:GND) IC18.4(P:GND) IC18.5(P:GND) IC18.6(P:GND) IC18.7(P:GND) IC19.4(P:GND) IC19.5(P:GND) IC20.4(P:GND) IC20.5(P:GND) IC20.6(P:GND) IC20.7(P:GND) IC21.4(P:GND) IC21.5(P:GND) IC22.4(P:GND) IC22.5(P:GND) IC22.6(P:GND) IC22.7(P:GND) IC23.4(P:GND) IC23.5(P:GND) IC24.4(P:GND) IC24.5(P:GND) IC24.6(P:GND) IC24.7(P:GND) IC25.4(P:GND) IC25.5(P:GND) IC26.4(P:GND) IC26.5(P:GND) IC26.6(P:GND) IC26.7(P:GND) IC27.4(P:GND) IC27.5(P:GND) IC32.16(GND) IC43.12(P:GND) IC44.12(P:GND) IC45.10(GND) IC47.10(GND) IC51.6(GND) IC54.6(GND) IC54.7(GND) IC54.8(GND) IC54.9(GND) IC61.4(GND) IC61.10(GND) IC61.15(GND) IC61.21(GND) IC61.28(GND) IC61.34(GND) IC61.39(GND) IC61.45(GND) OK1.E1(GND) OK1.E2(GND) XR1.3(GND)
V+: IC55.8(P:V+)
V-: IC55.4(P:V-)
VCC: DIS1.2(VCC) IC2.20(VCC) IC4.32(VCC) IC5.12(VCC) IC6.24(P:VCC) IC8.20(VCC) IC9.7(VCC) IC10.15(P:VCC) IC10.16(P:VCC) IC11.24(P:VCC) IC13.12(P:VCC) IC13.13(P:VCC) IC14.15(P:VCC) IC14.16(P:VCC) IC15.12(P:VCC) IC15.13(P:VCC) IC16.15(P:VCC) IC16.16(P:VCC) IC17.12(P:VCC) IC17.13(P:VCC) IC18.15(P:VCC) IC18.16(P:VCC) IC19.12(P:VCC) IC19.13(P:VCC) IC20.15(P:VCC) IC20.16(P:VCC) IC21.12(P:VCC) IC21.13(P:VCC) IC22.15(P:VCC) IC22.16(P:VCC) IC23.12(P:VCC) IC23.13(P:VCC) IC24.15(P:VCC) IC24.16(P:VCC) IC25.12(P:VCC) IC25.13(P:VCC) IC26.15(P:VCC) IC26.16(P:VCC) IC27.12(P:VCC) IC27.13(P:VCC) IC32.32(VCC) IC43.24(P:VCC) IC44.24(P:VCC) IC45.20(VCC) IC47.20(VCC) IC51.1(VCC) IC54.21(VCC) IC54.22(VCC) IC61.7(VCC) IC61.18(VCC) IC61.31(VCC) IC61.42(VCC) XR1.1(VCC)
VDD: IC7.16(VDD) IC31.16(P:VDD) IC33.16(P:VDD) IC34.16(P:VDD) IC35.16(P:VDD) IC36.16(P:VDD) IC37.14(P:VDD) IC38.14(P:VDD) IC39.14(P:VDD) IC40.14(P:VDD) IC41.16(P:VDD) IC42.14(P:VDD) IC46.28(VDD) IC48.14(P:VDD) IC49.14(P:VDD) IC50.14(P:VDD) IC52.14(P:VDD) IC53.14(P:VDD) IC56.14(P:VDD) IC57.14(P:VDD) IC58.14(P:VDD) IC59.14(P:VDD) IC60.14(P:VDD)
VEE: IC51.7(VEE)
VSS: IC7.8(VSS) IC31.8(P:VSS) IC33.8(P:VSS) IC34.8(P:VSS) IC35.8(P:VSS) IC36.8(P:VSS) IC37.7(P:VSS) IC38.7(P:VSS) IC39.7(P:VSS) IC40.7(P:VSS) IC41.8(P:VSS) IC42.7(P:VSS) IC48.7(P:VSS) IC49.7(P:VSS) IC50.7(P:VSS) IC52.7(P:VSS) IC53.7(P:VSS) IC56.7(P:VSS) IC57.7(P:VSS) IC58.7(P:VSS) IC59.7(P:VSS) IC60.7(P:VSS)

## Library data of the parts
C1-C3 = rcl:C-US: CAPACITOR, American symbol
DIS1 = display-lcd:TUXGR_16X2_R2: Tuxgraphics LCD display 16x2 characters reflective, without background light Source: tuxgr_12x2_r2.pdf; OC_FARNELL: unknown; OC_NEWARK: unknown
IC2 IC8 IC45 = 74xx-eu:74*373: Octal D type transparent LATCH, edge triggered
IC3 = atmel:AT89S51-*: 8-bit Microcontroller with 4K BytesIn-System Programmable Flash Source: http://www.atmel.com/dyn/resources/prod_documents/doc2487.pdf
IC4 = am29-memory:AM29F010*: 1-Megabit FLASH MEMORY (128 K x 8 bit) 5 V-only
IC5 = 74ac-logic:74AC11238: 3 to 8 line DECODER/DEMULTIPLEXER
IC6 IC11 IC43 IC44 = 74xx-eu:74*873: 2 x 4-bit D type LATCH
IC7 = 45xx:4503: Tri-state hex BUFFER, 74C367, 80C97
IC9 = maxim:MAX233: RS232 TRANSCEIVER; MPN: MAX233ACPP+G36; OC_FARNELL: 1593332; OC_NEWARK: 89K3459
IC10 IC14 IC16 IC18 IC20 IC22 IC24 IC26 = 74ac-logic:74AC11034: Hex non-inverting DRIVER
IC12 IC28-IC30 = stepper_drivers_etc:L297A: ST-Microelectronics Stepper Motor Controller
IC13 IC15 IC17 IC19 IC21 IC23 IC25 IC27 = 74ac-logic:74AC11008: Quadruple 2-input AND
IC31 IC33-IC36 IC41 = 45xx:4572: INVERTER/OR/NOR (MC14572BCP)
IC32 = atmel:27C080: 8-Megabit (1Mx8) OTP EPROM; MPN: AT27C080-90JU; OC_FARNELL: 1455025; OC_NEWARK: 58M3823
IC37 = 40xx:4071: Quad 2-input OR
IC38 IC39 IC49 IC52 = 40xx:4069: Hex INVERTER
IC40 IC42 IC48 IC50 IC53 IC56-IC60 = 40xx:4081: Quad 2-input AND
IC46 = maxim:MAX161ACP: ANALOG/DIGITAL CONVERTER; MPN: MAX161ACPI+; OC_FARNELL: unknown; OC_NEWARK: 99K3007
IC47 = 74xx-eu:74*573: 8-bit D latch BUS DRIVER
IC51 = linear:MC1408: 8-bit Multiplying D/A Converter Source: http://www.onsemi.com/pub/Collateral/MC1408 DATASHEET.PDF
IC54 = 74xx-eu:74*845: 8-bit bus interface LATCH
IC55 = analog-devices:AD822: Single-Supply, Rail-to-Rail Low Power FET-Input Op Amp Source: http://www.analog.com/static/imported-files/data_sheets/AD822.pdf; OC_FARNELL: 1438581; OC_NEWARK: unknown
IC61 = 74ac-logic:74AC16373: 16-bit transparent D-type LATCH, 3-state
LED1-LED8 = led:*P4: PointLED® Enhanced Thinfilm LED TOP & BOTTOM mount LS P47F, LR P47F, LA P47F, LY P47F, LT P4SG, LB P4SG, LW P4SG Source: http://catalog.osram-os.com .. LA_LR_LS_LY_P47F_Pb_free.pdf
OK1 = optocoupler:AEDR-8300-K: Agilent AEDR-8300 Series Encoders Reflective Surface Mount Optical Encoder Source: http: http://www.avagotech.com .. AV02-0088EN-1.pdf; MF: AGILENT TECHNOLOGIES; MPN: AEDR-8300-1P2; OC_FARNELL: 1161102; OC_NEWARK: 08J1020
Q1 = crystal:86SMX: CRYSTAL; MF: C-MAC FREQUENCY PRODUCTS LTD; MPN: XTAL003321- 86SMX; OC_FARNELL: 6344914; OC_NEWARK: 01H9866
R1-R9 = resistor:R-US_: RESISTOR, American symbol
R10 = rcl:R-US_: RESISTOR, American symbol
S1 = smd-special:SWS001: SMD Dip Switch 1 pol.
U$6 = keypad4x4_ece:KEYPAD4X4
X1 = con-subd:F09: SUB-D; OC_FARNELL: unknown; OC_NEWARK: unknown
XR1 = opto-honeywell:HFD3000: OPTO SENSOR DEVICE; OC_FARNELL: unknown; OC_NEWARK: unknown